# Altium schematic sheet 02_AFE.SchDoc: BioGAP ExG shield
size A3; Author: Sebastian Frey; DrawnBy: Sebastian Frey; Engineer: Sebastian Frey; Organization: Integrated System Laboratory; DocumentNumber: 2; Revision: v1.0; SheetNumber: 2; SheetTotal: 4
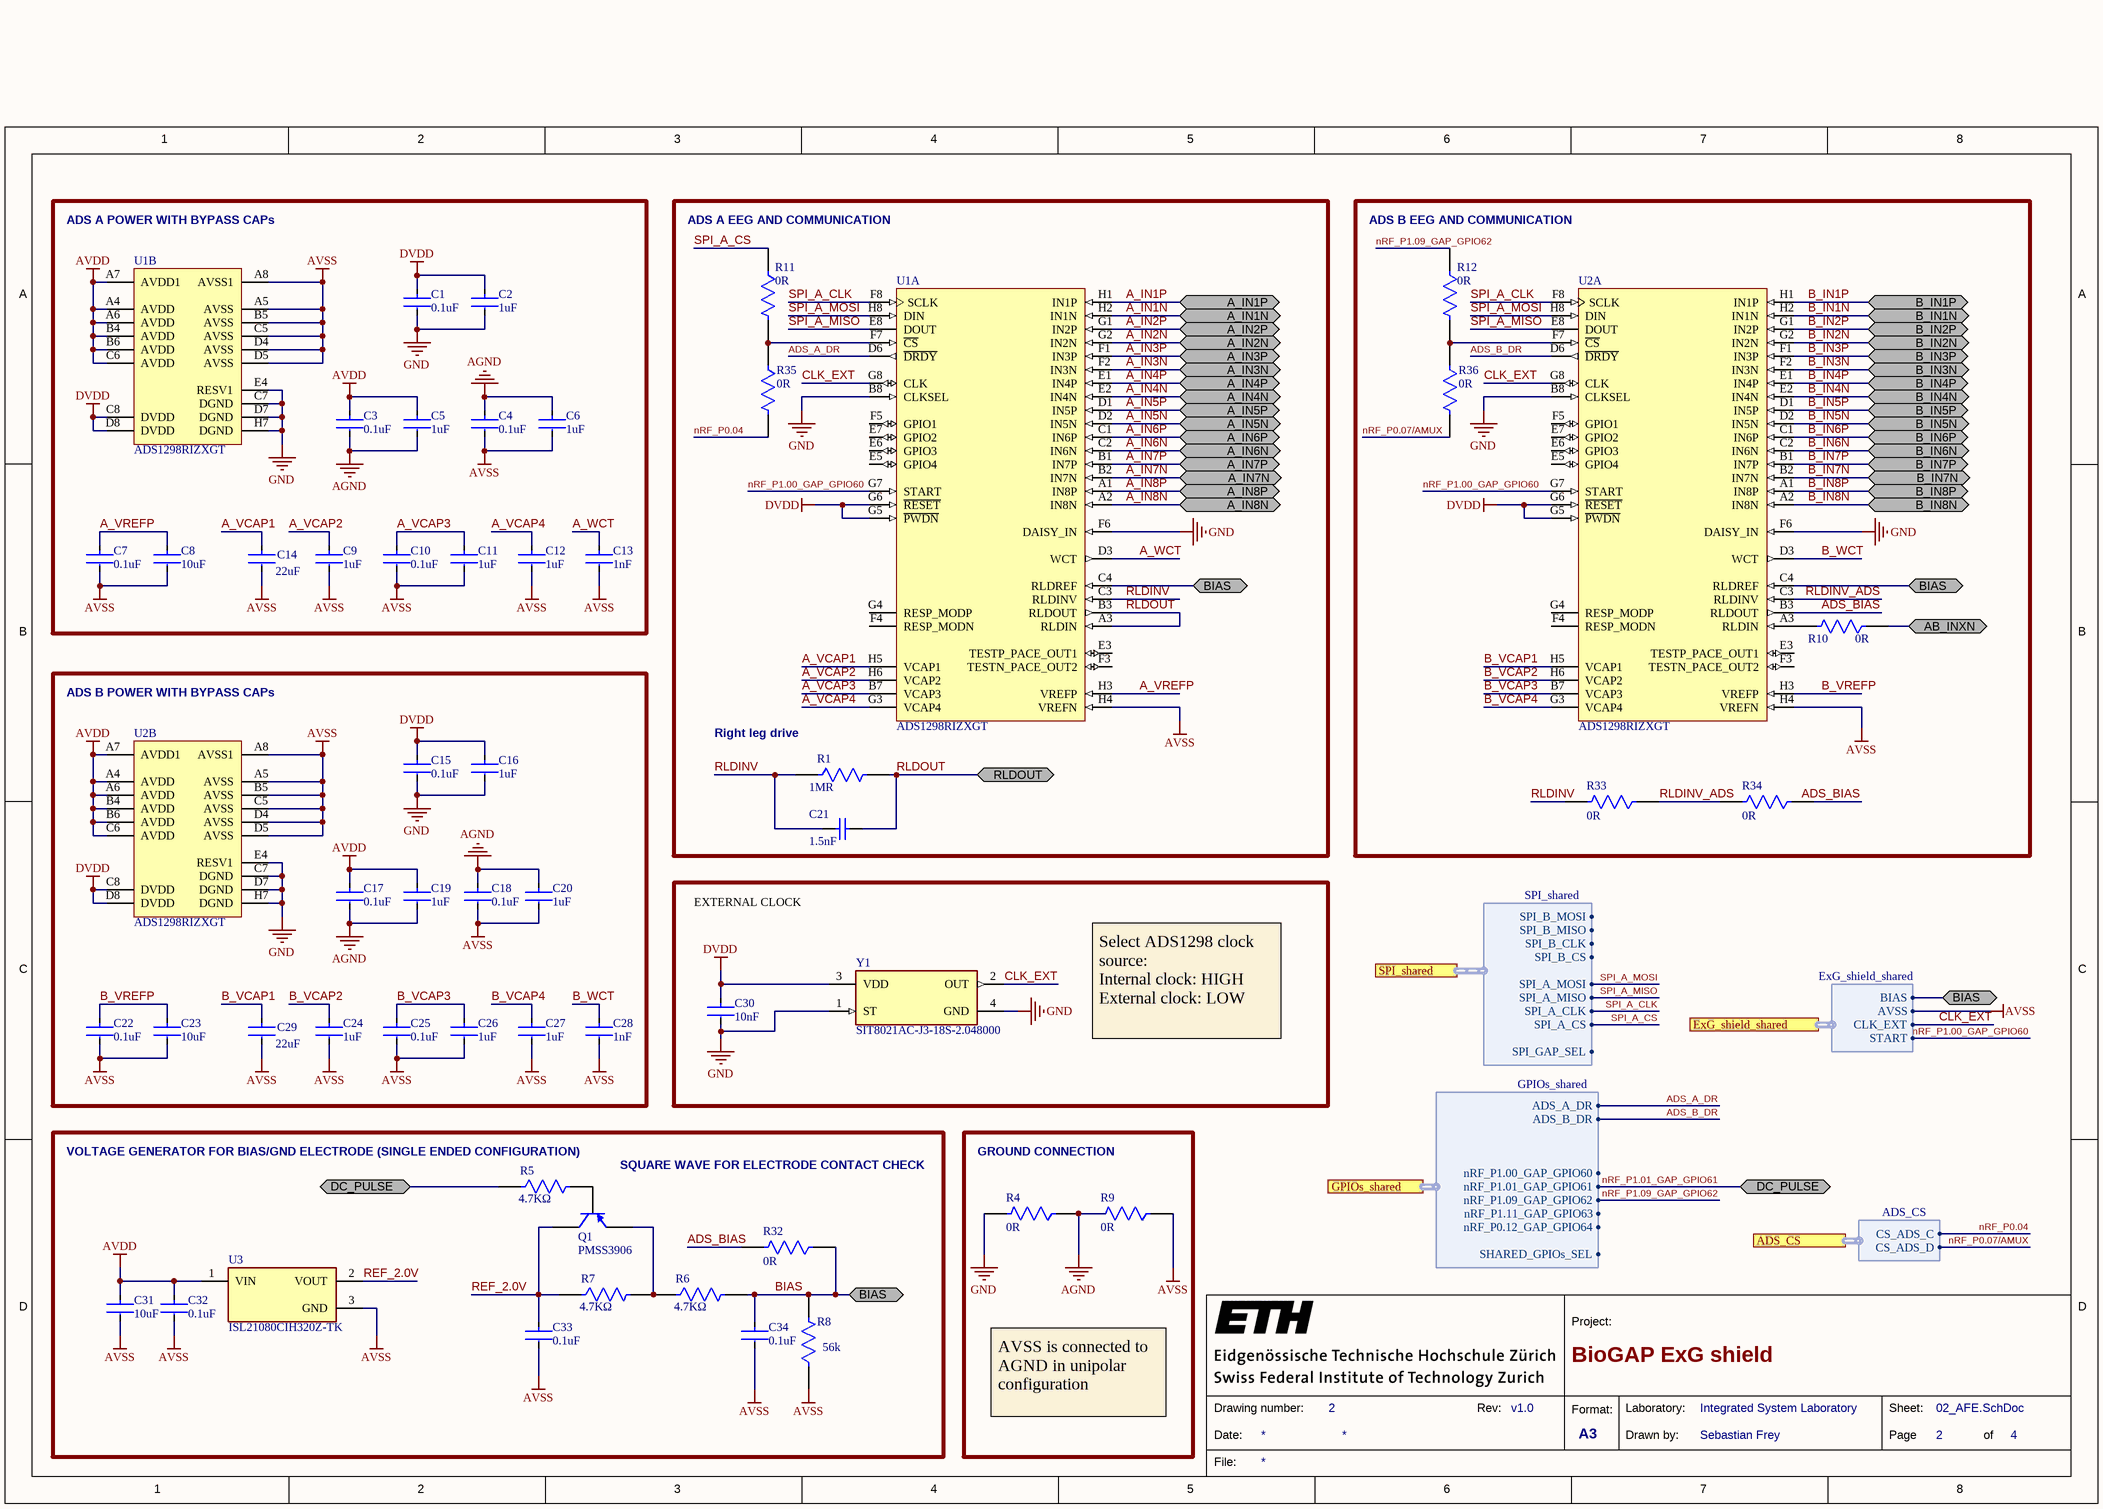
[diagram p0: 02_AFE.SchDoc]

## Parts
C1  Capacitance: 0.1uF  [FP-CL278-IPC_C]  (hidden comment: CL05A104KA5NNNC)
C2  Capacitance: 1uF  [FP-CL511-IPC_C]  (hidden comment: CL05A105KP5NNNC)
C3  Capacitance: 0.1uF  [FP-CL278-IPC_C]  (hidden comment: CL05A104KA5NNNC)
C4  Capacitance: 0.1uF  [FP-CL278-IPC_C]  (hidden comment: CL05A104KA5NNNC)
C5  Capacitance: 1uF  [FP-CL511-IPC_C]  (hidden comment: CL05A105KP5NNNC)
C6  Capacitance: 1uF  [FP-CL511-IPC_C]  (hidden comment: CL05A105KP5NNNC)
C7  Capacitance: 0.1uF  [FP-CL278-IPC_C]  (hidden comment: CL05A104KA5NNNC)
C8  Capacitance: 10uF  [FP-CL07-IPC_C]  (hidden comment: CL05A106MP8NUB8)
C9  Capacitance: 1uF  [FP-CL511-IPC_C]  (hidden comment: CL05A105KP5NNNC)
C10  Capacitance: 0.1uF  [FP-CL278-IPC_C]  (hidden comment: CL05A104KA5NNNC)
C11  Capacitance: 1uF  [FP-CL511-IPC_C]  (hidden comment: CL05A105KP5NNNC)
C12  Capacitance: 1uF  [FP-CL511-IPC_C]  (hidden comment: CL05A105KP5NNNC)
C13  Capacitance: 1nF  [FP-0402-L_1_0_1-W_0_5_0_1-IPC_B]  (hidden comment: 04025C102KAT2A)
C14  Capacitance: 22uF  [FP-CL746-IPC_C]  (hidden comment: CL05A226MQ5QUNC)
C15  Capacitance: 0.1uF  [FP-CL278-IPC_C]  (hidden comment: CL05A104KA5NNNC)
C16  Capacitance: 1uF  [FP-CL511-IPC_C]  (hidden comment: CL05A105KP5NNNC)
C17  Capacitance: 0.1uF  [FP-CL278-IPC_C]  (hidden comment: CL05A104KA5NNNC)
C18  Capacitance: 0.1uF  [FP-CL278-IPC_C]  (hidden comment: CL05A104KA5NNNC)
C19  Capacitance: 1uF  [FP-CL511-IPC_C]  (hidden comment: CL05A105KP5NNNC)
C20  Capacitance: 1uF  [FP-CL511-IPC_C]  (hidden comment: CL05A105KP5NNNC)
C21  Capacitance: 1.5nF  [CAPC1005X55X25NL05T10]  (hidden comment: GRM155R71H152KA01D)
C22  Capacitance: 0.1uF  [FP-CL278-IPC_C]  (hidden comment: CL05A104KA5NNNC)
C23  Capacitance: 10uF  [FP-CL07-IPC_C]  (hidden comment: CL05A106MP8NUB8)
C24  Capacitance: 1uF  [FP-CL511-IPC_C]  (hidden comment: CL05A105KP5NNNC)
C25  Capacitance: 0.1uF  [FP-CL278-IPC_C]  (hidden comment: CL05A104KA5NNNC)
C26  Capacitance: 1uF  [FP-CL511-IPC_C]  (hidden comment: CL05A105KP5NNNC)
C27  Capacitance: 1uF  [FP-CL511-IPC_C]  (hidden comment: CL05A105KP5NNNC)
C28  Capacitance: 1nF  [FP-0402-L_1_0_1-W_0_5_0_1-IPC_B]  (hidden comment: 04025C102KAT2A)
C29  Capacitance: 22uF  [FP-CL746-IPC_C]  (hidden comment: CL05A226MQ5QUNC)
C30  Capacitance: 10nF  [FP-CGA2B-MFG]  (hidden comment: CGA2B3X7R1V103K050BB)
C31  Capacitance: 10uF  [FP-CL07-IPC_C]  (hidden comment: CL05A106MP8NUB8)
C32  Capacitance: 0.1uF  [FP-CL278-IPC_C]  (hidden comment: CL05A104KA5NNNC)
C33  Capacitance: 0.1uF  [FP-CL278-IPC_C]  (hidden comment: CL05A104KA5NNNC)
C34  Capacitance: 0.1uF  [FP-CL278-IPC_C]  (hidden comment: CL05A104KA5NNNC)
Q1  PMSS3906  [SOT323_N]
R1  Resistance: 1MR  [FP-MCS0402-IPC_C]  (hidden comment: MCS04020C1004FE000)
R4  Resistance: 0R  [FP-RC0402-0_4-IPC_A]  (hidden comment: RC0402FR-070RL)
R5  value 4.7KΩ  [FP-RT0402-MFG]  (hidden comment: RT0402FRE074K7L)
R6  value 4.7KΩ  [FP-RT0402-MFG]  (hidden comment: RT0402FRE074K7L)
R7  value 4.7KΩ  [FP-RT0402-MFG]  (hidden comment: RT0402FRE074K7L)
R8  Resistance: 56k  [FP-RR0510-MFG]  (hidden comment: RR0510P-563-D)
R9  Resistance: 0R  [FP-RC0402-0_4-IPC_A]  (hidden comment: RC0402FR-070RL)
R10  Resistance: 0R  [FP-RC0402-0_4-IPC_C]  (hidden comment: RC0402FR-070RL)
R11  Resistance: 0R  [FP-RC0402-0_4-IPC_C]  (hidden comment: RC0402FR-070RL)
R12  Resistance: 0R  [FP-RC0402-0_4-IPC_C]  (hidden comment: RC0402FR-070RL)
R32  Resistance: 0R  [FP-RC0402-0_4-IPC_C]  (hidden comment: RC0402FR-070RL)
R33  Resistance: 0R  [FP-RC0402-0_4-IPC_C]  (hidden comment: RC0402FR-070RL)
R34  Resistance: 0R  [FP-RC0402-0_4-IPC_C]  (hidden comment: RC0402FR-070RL)
R35  Resistance: 0R  [FP-RC0402-0_4-IPC_C]  (hidden comment: RC0402FR-070RL)
R36  Resistance: 0R  [FP-RC0402-0_4-IPC_C]  (hidden comment: RC0402FR-070RL)
U1  ADS1298RIZXGT  [TI-ZXG64]  (parts A,B of 2)
U2  ADS1298RIZXGT  [TI-ZXG64]  (parts A,B of 2)
U3  ISL21080CIH320Z-TK  [FP-P3_064A-IPC_C]
Y1  SIT8021AC-J3-18S-2.048000  [FP-SiT8021-MFG]

## Blocks framed on the sheet
ADS A POWER WITH BYPASS CAPs: C1-C14 U1
ADS B EEG AND COMMUNICATION: R10 R12 R33 R34 R36 U2
ADS B POWER WITH BYPASS CAPs: C15-C20 C22-C29 U2
SQUARE WAVE FOR ELECTRODE CONTACT CHECK: C31-C34 Q1 R5-R8 R32 U3
GROUND CONNECTION: R4 R9

## Ports
A_IN1N (bidir), A_IN1P (bidir), A_IN2N (bidir), A_IN2P (bidir), A_IN3N (bidir), A_IN3P (bidir), A_IN4N (bidir), A_IN4P (bidir), A_IN5N (bidir), A_IN5P (bidir), A_IN6N (bidir), A_IN6P (bidir), A_IN7N (bidir), A_IN7P (bidir), A_IN8N (bidir), A_IN8P (bidir), AB_INXN (bidir), ADS_CS (harness ADS_CS), B_IN1N (bidir), B_IN1P (bidir), B_IN2N (bidir), B_IN2P (bidir), B_IN3N (bidir), B_IN3P (bidir), B_IN4N (bidir), B_IN4P (bidir), B_IN5N (bidir), B_IN5P (bidir), B_IN6N (bidir), B_IN6P (bidir), B_IN7N (bidir), B_IN7P (bidir), B_IN8N (bidir), B_IN8P (bidir), BIAS (bidir), DC_PULSE (bidir), ExG_shield_shared (harness ExG_shield_shared), GPIOs_shared (harness GPIOs_shared), RLDOUT (bidir), SPI_shared (harness SPI_shared)

## Harnesses
SPI_shared: SPI_B_MOSI, SPI_B_MISO, SPI_B_CLK, SPI_B_CS, SPI_A_MOSI, SPI_A_MISO, SPI_A_CLK, SPI_A_CS, SPI_GAP_SEL
GPIOs_shared: ADS_A_DR, ADS_B_DR, nRF_P1.00_GAP_GPIO60, nRF_P1.09_GAP_GPIO62, nRF_P1.11_GAP_GPIO63, nRF_P0.12_GAP_GPIO64, SHARED_GPIOs_SEL, nRF_P1.01_GAP_GPIO61
ExG_shield_shared: BIAS, AVSS, CLK_EXT, START
ADS_CS: CS_ADS_C, CS_ADS_D

## Nets
AGND: C3.2 C4.1 C5.2 C6.1 C17.2 C18.1 C19.2 C20.1 R4.1 R9.2
AVDD: C3.1 C5.1 C17.1 C19.1 C31.1 C32.1 U1.A4(AVDD) U1.A6(AVDD) U1.A7(AVDD1) U1.B4(AVDD) U1.B6(AVDD) U1.C6(AVDD) U2.A4(AVDD) U2.A6(AVDD) U2.A7(AVDD1) U2.B4(AVDD) U2.B6(AVDD) U2.C6(AVDD) U3.1(VIN)
AVSS: C4.2 C6.2 C7.2 C8.2 C9.2 C10.2 C11.2 C12.2 C13.2 C14.2 C18.2 C20.2 C22.2 C23.2 C24.2 C25.2 C26.2 C27.2 C28.2 C29.2 C31.2 C32.2 C33.2 C34.2 R8.1 R9.1 U1.A5(AVSS) U1.A8(AVSS1) U1.B5(AVSS) U1.C5(AVSS) U1.D4(AVSS) U1.D5(AVSS) U1.H4(VREFN) U2.A5(AVSS) U2.A8(AVSS1) U2.B5(AVSS) U2.C5(AVSS) U2.D4(AVSS) U2.D5(AVSS) U2.H4(VREFN) U3.3(GND) ; port ExG_shield_shared.AVSS
DVDD: C1.1 C2.1 C15.1 C16.1 C30.1 U1.C8(DVDD) U1.D8(DVDD) U1.G5(~{PWDN}) U1.G6(~{RESET}) U2.C8(DVDD) U2.D8(DVDD) U2.G5(~{PWDN}) U2.G6(~{RESET}) Y1.3(VDD)
GND: C1.2 C2.2 C15.2 C16.2 C30.2 R4.2 U1.B8(CLKSEL) U1.C7(DGND) U1.D7(DGND) U1.E4(RESV1) U1.F6(DAISY_IN) U1.H7(DGND) U2.B8(CLKSEL) U2.C7(DGND) U2.D7(DGND) U2.E4(RESV1) U2.F6(DAISY_IN) U2.H7(DGND) Y1.1(ST) Y1.4(GND)
A_IN1N: U1.H2(IN1N) ; port A_IN1N
A_IN1P: U1.H1(IN1P) ; port A_IN1P
A_IN2N: U1.G2(IN2N) ; port A_IN2N
A_IN2P: U1.G1(IN2P) ; port A_IN2P
A_IN3N: U1.F2(IN3N) ; port A_IN3N
A_IN3P: U1.F1(IN3P) ; port A_IN3P
A_IN4N: U1.E2(IN4N) ; port A_IN4N
A_IN4P: U1.E1(IN4P) ; port A_IN4P
A_IN5N: U1.D2(IN5N) ; port A_IN5N
A_IN5P: U1.D1(IN5P) ; port A_IN5P
A_IN6N: U1.C2(IN6N) ; port A_IN6N
A_IN6P: U1.C1(IN6P) ; port A_IN6P
A_IN7N: U1.B2(IN7N) ; port A_IN7N
A_IN7P: U1.B1(IN7P) ; port A_IN7P
A_IN8N: U1.A2(IN8N) ; port A_IN8N
A_IN8P: U1.A1(IN8P) ; port A_IN8P
A_VCAP1: C14.1 U1.H5(VCAP1)
A_VCAP2: C9.1 U1.H6(VCAP2)
A_VCAP3: C10.1 C11.1 U1.B7(VCAP3)
A_VCAP4: C12.1 U1.G3(VCAP4)
A_VREFP: C7.1 C8.1 U1.H3(VREFP)
A_WCT: C13.1 U1.D3(WCT)
AB_INXN: R10.1 ; port AB_INXN
ADS_A_DR: U1.D6(~{DRDY}) ; port GPIOs_shared.ADS_A_DR
ADS_B_DR: U2.D6(~{DRDY}) ; port GPIOs_shared.ADS_B_DR
ADS_BIAS: R32.2 R34.1 U2.B3(RLDOUT)
B_IN1N: U2.H2(IN1N) ; port B_IN1N
B_IN1P: U2.H1(IN1P) ; port B_IN1P
B_IN2N: U2.G2(IN2N) ; port B_IN2N
B_IN2P: U2.G1(IN2P) ; port B_IN2P
B_IN3N: U2.F2(IN3N) ; port B_IN3N
B_IN3P: U2.F1(IN3P) ; port B_IN3P
B_IN4N: U2.E2(IN4N) ; port B_IN4N
B_IN4P: U2.E1(IN4P) ; port B_IN4P
B_IN5N: U2.D2(IN5N) ; port B_IN5N
B_IN5P: U2.D1(IN5P) ; port B_IN5P
B_IN6N: U2.C2(IN6N) ; port B_IN6N
B_IN6P: U2.C1(IN6P) ; port B_IN6P
B_IN7N: U2.B2(IN7N) ; port B_IN7N
B_IN7P: U2.B1(IN7P) ; port B_IN7P
B_IN8N: U2.A2(IN8N) ; port B_IN8N
B_IN8P: U2.A1(IN8P) ; port B_IN8P
B_VCAP1: C29.1 U2.H5(VCAP1)
B_VCAP2: C24.1 U2.H6(VCAP2)
B_VCAP3: C25.1 C26.1 U2.B7(VCAP3)
B_VCAP4: C27.1 U2.G3(VCAP4)
B_VREFP: C22.1 C23.1 U2.H3(VREFP)
B_WCT: C28.1 U2.D3(WCT)
BIAS: C34.1 R6.2 R8.2 R32.1 U1.C4(RLDREF) U2.C4(RLDREF) ; port BIAS, port ExG_shield_shared.BIAS
CLK_EXT: U1.G8(CLK) U2.G8(CLK) Y1.2(OUT) ; port ExG_shield_shared.CLK_EXT
nRF_P0.04: R35.2 ; port ADS_CS.CS_ADS_C
nRF_P0.07/AMUX: R36.2 ; port ADS_CS.CS_ADS_D
nRF_P1.00_GAP_GPIO60: U1.G7(START) U2.G7(START) ; port ExG_shield_shared.START
nRF_P1.01_GAP_GPIO61: R5.1 ; port DC_PULSE, port GPIOs_shared.nRF_P1.01_GAP_GPIO61
nRF_P1.09_GAP_GPIO62: R12.1 ; port GPIOs_shared.nRF_P1.09_GAP_GPIO62
REF_2.0V: C33.1 Q1.3(C) R7.1 U3.2(VOUT)
RLDINV: C21.1 R1.1 R33.2 U1.C3(RLDINV)
RLDINV_ADS: R33.1 R34.2 U2.C3(RLDINV)
RLDOUT: C21.2 R1.2 U1.A3(RLDIN) U1.B3(RLDOUT) ; port RLDOUT
SPI_A_CLK: U1.F8(SCLK) U2.F8(SCLK) ; port SPI_shared.SPI_A_CLK
SPI_A_CS: R11.1 ; port SPI_shared.SPI_A_CS
SPI_A_MISO: U1.E8(DOUT) U2.E8(DOUT) ; port SPI_shared.SPI_A_MISO
SPI_A_MOSI: U1.H8(DIN) U2.H8(DIN) ; port SPI_shared.SPI_A_MOSI
NetQ1_1: Q1.1(B) R5.2
NetQ1_2: Q1.2(E) R6.1 R7.2
NetR10_2: R10.2 U2.A3(RLDIN)
NetR11_2: R11.2 R35.1 U1.F7(~{CS})
NetR12_2: R12.2 R36.1 U2.F7(~{CS})

Not connected (* = marked no-connect by the designer): U1 E3(TESTP_PACE_OUT1) E5(GPIO4) E6(GPIO3) E7(GPIO2) F3(TESTN_PACE_OUT2) F4(RESP_MODN) F5(GPIO1) G4(RESP_MODP); U2 E3(TESTP_PACE_OUT1) E5(GPIO4) E6(GPIO3) E7(GPIO2) F3(TESTN_PACE_OUT2) F4(RESP_MODN) F5(GPIO1) G4(RESP_MODP)

## Notes on the sheet
- (near R11) ADS A EEG AND COMMUNICATION
- (near R1) Right leg drive
- EXTERNAL CLOCK
- Select ADS1298 clock source:
  Internal clock: HIGH
  External clock: LOW
- (near R5) VOLTAGE GENERATOR FOR BIAS/GND ELECTRODE (SINGLE ENDED CONFIGURATION)
- AVSS is connected to AGND in unipolar configuration
- 1
- 2
- 3
- 4
- 5
- 6
- 7
- 8
- A
- B
- C
- D
- Project:
- Date:
- Drawing number:
- Rev:
- Format:
- A3
- Drawn by:
- Laboratory:
- Page
- Sheet:
- of
- File:

## Library data of the parts
C1 C3 C4 C7 C10 C15 C17 C18 C22 C25 C32-C34 = CMP-13271-000728-1: Cap Ceramic 100nF 25V X5R ±10% SMD 0402 +85°C Paper T/R; Package Quantity: 1; Height: 0.5mm; Case Code (Metric): 1005; Thickness: 0.022inch; Mount: Surface Mount; Lead Free: Lead Free; Case Code (Imperial): 0402; Packaging: Tape and Reel; Depth: 0.5mm; Voltage: 25V; Min Operating Temperature: -55°C; Voltage Rating: 25V; Dielectric: X5R; Case/Package: 0402; Tolerance: 10%; Width: 0.02inch; Max Operating Temperature: 85°C; Length: 1mm; Radiation Hardening: No; Voltage Rating (DC): 25V
C2 C5 C6 C9 C11 C12 C16 C19 C20 C24 C26 C27 = CMP-13271-001936-1: Cap Ceramic 1uF 10V X5R ±10% SMD 0402 +85°C Paper T/R; Depth: 0.5mm; Case Code (Imperial): 0402; Material: Ceramic; Mount: Surface Mount; Thickness: 0.022inch; Dielectric: X5R; Radiation Hardening: No; Case/Package: 0402; Length: 1mm; Tolerance: 10%; Max Operating Temperature: 85°C; Package Quantity: 1; Width: 0.02inch; Voltage Rating: 10V; Contact Plating: Tin; Height: 0.5mm; Min Operating Temperature: -55°C; Case Code (Metric): 1005; Packaging: Tape and Reel
C8 C23 C31 = CMP-13271-002778-1: Cap Ceramic 10uF 10V X5R ±20% SMD 0402 +85°C Paper T/R; Length: 0.039inch; Mount: Surface Mount; Case Code (Imperial): 0402; Max Operating Temperature: 85°C; Voltage Rating: 10V; Min Operating Temperature: -55°C; Case/Package: 0402; Thickness: 0.035inch; Width: 0.02inch; Case Code (Metric): 1005; Packaging: Tape and Reel; Tolerance: 20%
C13 C28 = CMP-2008-02699-2: General Purpose Ceramic Capacitor, 0402, 1nF, 10%, X7R, 15%, 50V; Insulation Resistance: 100GR; Dissipation Factor: 2.5%; Series: -; RoHS Compliant: Yes; Length: 1mm; Tolerance: 10%; Thickness: 0.022inch; Packaging: Tape and Reel; Voltage: 50V; Voltage Rating: 50V; Dielectric: X7R; Case Code (Imperial): 0402; Number of Pins: 2; Case/Package: 0402; Radiation Hardening: No; Width: 0.02inch; Depth: 0.5mm; REACH SVHC: No SVHC; Min Operating Temperature: -55°C; Termination: SMD/SMT; Voltage Rating (DC): 50V; Mount: Surface Mount; Construction: Flat; Case Code (Metric): 1005; Max Operating Temperature: 125°C; Lead Free: Lead Free; Package Quantity: 1; Contact Plating: Tin; Height: 0.56mm
C14 C29 = CMP-13271-000286-1: Cap Ceramic 22uF 6.3V X5R ±20% SMD 0402 +85°C Paper T/R; Case Code (Imperial): 0402; Tolerance: 20%; Width: 0.02inch; Packaging: Tape and Reel; Case/Package: 0402; Min Operating Temperature: -55°C; Max Operating Temperature: 85°C; Voltage Rating: 6.3V; Thickness: 0.022inch; Mount: Surface Mount; Length: 0.039inch; Case Code (Metric): 1005
C21 = CMP-2008-04642-1: Manufacturer: Murata; Part Number: GRM155R71H152KA01D
C30 = CMP-08246-000497-1: Cap Ceramic 10nF 35V X7R 10% Pad SMD 0402 +125°C Automotive T/R; Packaging: Tape and Reel; Case Code (Metric): 1005; Max Operating Temperature: 125°C; Case Code (Imperial): 0402; Voltage Rating (DC): 35V; Min Operating Temperature: -55°C; Voltage Rating: 35V; Termination: SMD/SMT; Case/Package: 0402; Dielectric: X7R; Tolerance: 10%; Lead Free: Lead Free
Q1 = PMSS3906: PNP Switching Transistor; Published: 17-Sep-2003; LatestRevisionDate: 12-Dec-2006; LatestRevisionNote: IPC-7351 Footprint Added.; DatasheetVersion: 22-Apr-1999; PackageVersion: Apr-1999; PackageReference: SOT323; Publisher: Altium Limited; PackageDescription: 3-Pin SOT-323 Package 0.65 mm Pitch, 2.1 mm Lead Span; ComponentLink1Description: Manufacturer Link; ComponentLink1URL: http://www.semiconductors.philips.com/; ComponentLink2Description: Datasheet; ComponentLink2URL: http://www.semiconductors.philips.com/acrobat/datasheets/PMSS3906_4.pdf
R1 = CMP-02407-000443-1: RES SMD 1M OHM 1% 1/10W 0402; Voltage Rating (DC): 50V; Temperature Coefficient: 50ppm/°C; Power Rating: 63mW; Max Power Dissipation: 100mW; Radiation Hardening: No; Tolerance: 1%; Packaging: Tape and Reel; Case/Package: 0402; Case Code (Imperial): 0402; Width: 0.5mm; Lead Free: Lead Free; Composition: Thin Film; Mount: Surface Mount; Weight: 2.1E-05oz; Number of Terminations: 2; REACH SVHC: No SVHC; Depth: 0.5mm; Min Operating Temperature: -55°C; Height: 0.015inch; Max Operating Temperature: 125°C; Case Code (Metric): 1005; Package Quantity: 1; Military Standard: Not; Voltage Rating: 50V; Contact Plating: Tin; Length: 1mm
R4 R9-R12 R32-R36 = CMP-2002-07342-2: RES SMD 0 OHM JUMPER 1/16W 0402; Temperature Coefficient: 200ppm/°C; Tolerance: 1%; Power Rating: 62.5mW; Voltage Rating: 50V; Max Power Dissipation: 63mW; Features: Moisture Resistant; Length: 1mm; Case Code (Metric): 1005; Series: RC; RoHS Compliant: Yes; Resistor Type: Thick Film; Height: 0.35mm; Min Operating Temperature: -55°C; Case Code (Imperial): 0402; Number of Terminations: 2; Contact Plating: Tin; Case/Package: 0402; Size Code: 0402; Termination: SMD/SMT; Max Operating Temperature: 155°C; Width: 0.5mm; Mount: Surface Mount; Lead Free: Lead Free; Packaging: Tape and Reel; Radiation Hardening: No
R5-R7 = CMP-2002-02901-2: RES 4.70K OHM 1/16W 1% SMD 0402; Manufacturer: Yageo; Voltage Rating: 50V; Temperature Coefficient: 50 ppm/°C; Tolerance: 0.01; Power Rating: 0.063W; ComponentLink2URL: http://www.yageo.com/documents/recent/PYu-RT_1-to-0.01_RoHS_L_9.pdf; Temperature Range High: +155°C; Mouser Description: Res Thin Film 0402 4.7K Ohm 1% 1/16W ±50ppm/°C SMD Paper T/R; Temperature Range Low: -55°C; Device Class L1: Passive Components; Lead Free: Yes; Series: RT; Resistance: 4.7KΩ; Automotive: No; Manufacturer Part Number: RT0402FRE074K7L; Package: RT0402; Composition: Thin Film; RoHS: TRUE; ComponentLink2Description: Datasheet; Octopart: https://octopart.com/rt0402fre074k7l-yageo-1371922; Footprint Url: http://www.yageo.com/exep/pages/download/literatures/PYu-R_Mount_10.pdf; Height: 0.35mm; Category: Res; Device Class L3: Chip SMD Resistors; Temperature: -55°C to +155°C; Digikey Description: RES 4.70K OHM 1/16W 1% SMD 0402; Device Class L2: Resistors; Ipc Land Pattern Name: RESC10050X30
R8 = CMP-2002-01632-2: 56kΩ ±0.5% 0.0625W 1/16W Chip Resistor 0402 (1005 Metric) Thin Film; Max Power Dissipation: 63mW; Power Rating: 62.5mW; Temperature Coefficient: 25ppm/°C; Voltage Rating (DC): 25V; Series: RR; RoHS Compliant: Yes; Termination: SMD/SMT; Number of Pins: 2; Min Operating Temperature: -55°C; Resistance Tolerance: 0.5%; Case/Package: 0402; Max Operating Temperature: 125°C; Resistor Type: Thin Film; Packaging: Tape and Reel; Case Code (Metric): 1005; Voltage Rating: 25V; Case Code (Imperial): 0402; Number of Terminations: 2; Size Code: 0402; Lead Free: Lead Free; Tolerance: 0.5%
U1 U2 = CMP-0003-00996-1: 8-Channel, 24-Bit ADC with Integrated Respiration Impedance and ECG Front End, -40 to 85 degC, 64-pin BGA (ZXG64), Green (RoHS & no Sb/Br); Manufacturer: Texas Instruments; SNR(dB): 112; Architecture: Delta-Sigma; # Input Channels: 8; Digital Supply(Max)(V): 3.6; SubFamily: Precision ADC (<=10MSPS); Interface: Serial SPI; Analog Voltage AV/DD(Min)(V): 2.7; Analog Voltage AV/DD(Max)(V): 5.25; Sample Rate (max)(SPS): 32K; Resolution(Bits): 24; Digital Supply(Min)(V): 1.65; ComponentLink1URL: http://www.ti.com/; PackageVersion: 4206838/A, 02/2005; Eco-Plan: Green (RoHS & no Sb/Br); ComponentLink2URL: http://www.ti.com/general/docs/lit/getliterature.tsp?genericPartNumber=ADS1298R&fileType=pdf; PartNumber: ADS1298RIZXGT; ComponentLink3URL: http://www.ti.com/litv/pdf/mpbg581; DatasheetVersion: SBAS459I; PackageDescription: 64-Pin Plastic Ball Grid Array, Body 8 x 8 mm, Pitch 0.8 mm; ComponentLink1Description: Manufacturer URL; PackageReference: ZXG64; Mounting Technology: Surface Mount; ComponentLink2Description: Datasheet; ComponentLink3Description: Package Specification
U3 = CMP-13559-000004-1: IC VREF SERIES 0.3% SOT23-3; Operating Supply Current: 1.5uA; Temperature Coefficient: 50ppm/°C; Output Type: Fixed; Output Current: 7mA; Min Output Voltage: 2.048V; Tolerance: 0.3%; Packaging: Tape and Reel; RoHS Compliant: Yes; Reference Type: Series; Min Operating Temperature: -40°C; Max Operating Temperature: 85°C; Mount: Surface Mount; Case/Package: TO-236-3
Y1 = CMP-25159-259502-1: MEMS OSC 2.048MHZ LVCMOS; Frequency Stability: 50ppm; Packaging: Cut Tape; Series: SiT8021; Length: 0.061inch; Height: 0.024inch; RoHS Compliant: Yes; Min Operating Temperature: -40°C; Width: 0.033inch; Frequency: 2.048MHz; Max Operating Temperature: 85°C; Mount: Surface Mount